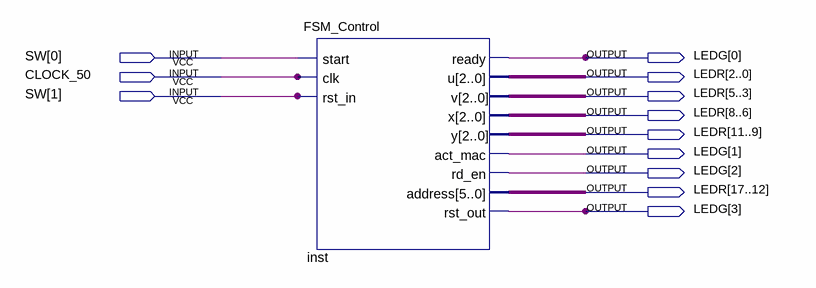
[diagram p0: schematic sheet]
// Quartus schematic FSM_Control2.bdf as structural Verilog: 1 symbols, 12 pins
module FSM_Control2 (
  input  [1:0] SW,
  input  CLOCK_50,
  output [3:0] LEDG,
  output [17:0] LEDR
);

  FSM_Control inst (
    .start(SW[0]), .clk(CLOCK_50), .rst_in(SW[1]), .ready(LEDG[0]), .u(LEDR[2:0]), .v(LEDR[5:3]),
    .x(LEDR[8:6]), .y(LEDR[11:9]), .act_mac(LEDG[1]), .rd_en(LEDG[2]), .address(LEDR[17:12]),
    .rst_out(LEDG[3]));
endmodule
